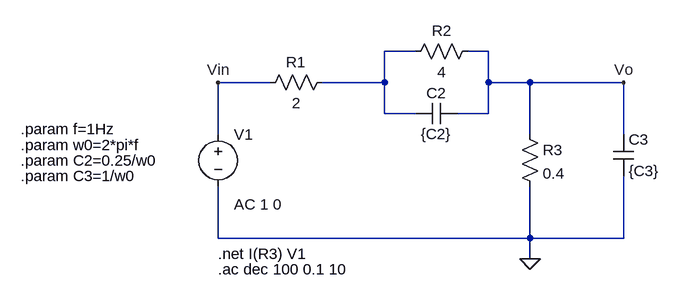
[diagram p0: schematic TS11_2_Y.asc]
TS11_2_Y.asc, the LTspice schematic file:
Version 4
SHEET 1 880 680
WIRE 272 64 224 64
WIRE 384 64 352 64
WIRE 48 112 -32 112
WIRE 224 112 224 64
WIRE 224 112 128 112
WIRE 384 112 384 64
WIRE 448 112 384 112
WIRE 592 112 448 112
WIRE 224 160 224 112
WIRE 272 160 224 160
WIRE 384 160 384 112
WIRE 384 160 336 160
WIRE -32 192 -32 112
WIRE 448 192 448 112
WIRE 592 192 592 112
WIRE -32 352 -32 272
WIRE 448 352 448 272
WIRE 448 352 -32 352
WIRE 592 352 592 256
WIRE 592 352 448 352
WIRE 448 384 448 352
FLAG 448 384 0
FLAG 592 112 Vo
FLAG -32 112 Vin
SYMBOL res 144 96 R90
WINDOW 0 0 56 VBottom 2
WINDOW 3 32 56 VTop 2
SYMATTR InstName R1
SYMATTR Value 2
SYMBOL res 368 48 R90
WINDOW 0 0 56 VBottom 2
WINDOW 3 32 56 VTop 2
SYMATTR InstName R2
SYMATTR Value 4
SYMBOL cap 336 144 R90
WINDOW 0 0 32 VBottom 2
WINDOW 3 32 32 VTop 2
SYMATTR InstName C2
SYMATTR Value {C2}
SYMBOL res 432 176 R0
SYMATTR InstName R3
SYMATTR Value 0.4
SYMBOL cap 576 192 R0
SYMATTR InstName C3
SYMATTR Value {C3}
SYMBOL voltage -32 176 R0
WINDOW 123 24 124 Left 2
WINDOW 39 0 0 Left 0
SYMATTR InstName V1
SYMATTR Value ""
SYMATTR Value2 AC 1 0
TEXT -336 184 Left 2 !.param f=1Hz
TEXT -336 208 Left 2 !.param w0=2*pi*f
TEXT -336 232 Left 2 !.param C2=0.25/w0
TEXT -336 256 Left 2 !.param C3=1/w0
TEXT -32 400 Left 2 !.ac dec 100 0.1 10
TEXT -32 376 Left 2 !.net I(R3) V1

The netlist it stands for:
* TS11_2_Y.asc
R1 N001 Vin 2
R2 Vo N001 4
C2 Vo N001 {C2}
R3 Vo 0 0.4
C3 Vo 0 {C3}
V1 Vin 0 AC 1 0
.param f=1Hz
.param w0=2*pi*f
.param C2=0.25/w0
.param C3=1/w0
.ac dec 100 0.1 10
.net I(R3) V1
.backanno
.end